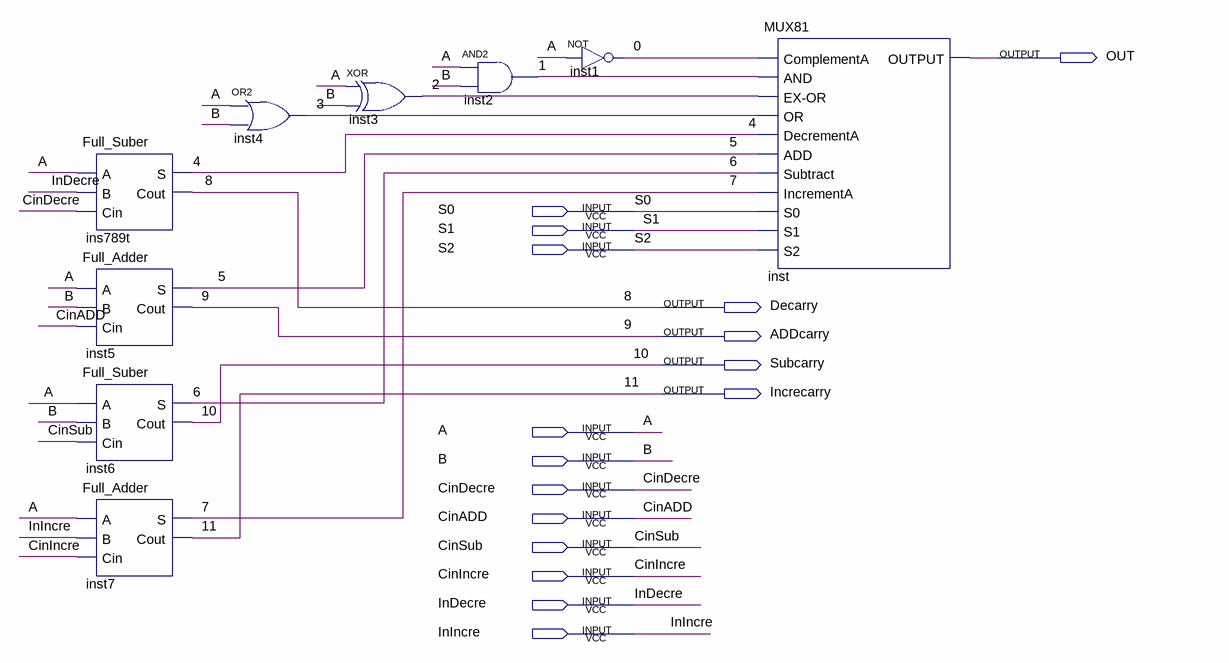
[diagram p0: schematic sheet]
// Quartus schematic ALU_1bit.bdf as structural Verilog: 9 symbols, 16 pins
module ALU_1bit (
  input  S0,
  input  S1,
  input  S2,
  input  A,
  input  B,
  input  CinDecre,
  input  CinADD,
  input  CinSub,
  input  CinIncre,
  input  InDecre,
  input  InIncre,
  output OUT,
  output Decarry,
  output ADDcarry,
  output Subcarry,
  output Increcarry
);

  wire \0 , \1 , \2 , \3 , \4 , \5 , \6 , \7 ;

  Full_Suber ins789t (.A(A), .B(InDecre), .Cin(CinDecre), .S(\4 ), .Cout(Decarry));
  Full_Adder inst5 (.A(A), .B(B), .Cin(CinADD), .S(\5 ), .Cout(ADDcarry));
  Full_Suber inst6 (.A(A), .B(B), .Cin(CinSub), .S(\6 ), .Cout(Subcarry));
  Full_Adder inst7 (.A(A), .B(InIncre), .Cin(CinIncre), .S(\7 ), .Cout(Increcarry));
  or inst4 (\3 , A, B);
  xor inst3 (\2 , A, B);
  and inst2 (\1 , A, B);
  not inst1 (\0 , A);
  MUX81 inst (
    .ComplementA(\0 ), .AND(\1 ), .\EX-OR (\2 ), .OR(\3 ), .DecrementA(\4 ), .ADD(\5 ), .Subtract(\6 ),
    .IncrementA(\7 ), .S0(S0), .S1(S1), .S2(S2), .OUTPUT(OUT));

  // Other names for the same wires on the sheet: 8 = Decarry; 9 = ADDcarry; 10 = Subcarry; 11 = Increcarry
endmodule
